# Altium schematic sheet Non-invasive glucose monitoring system.schdoc
size 304 x 194 mm
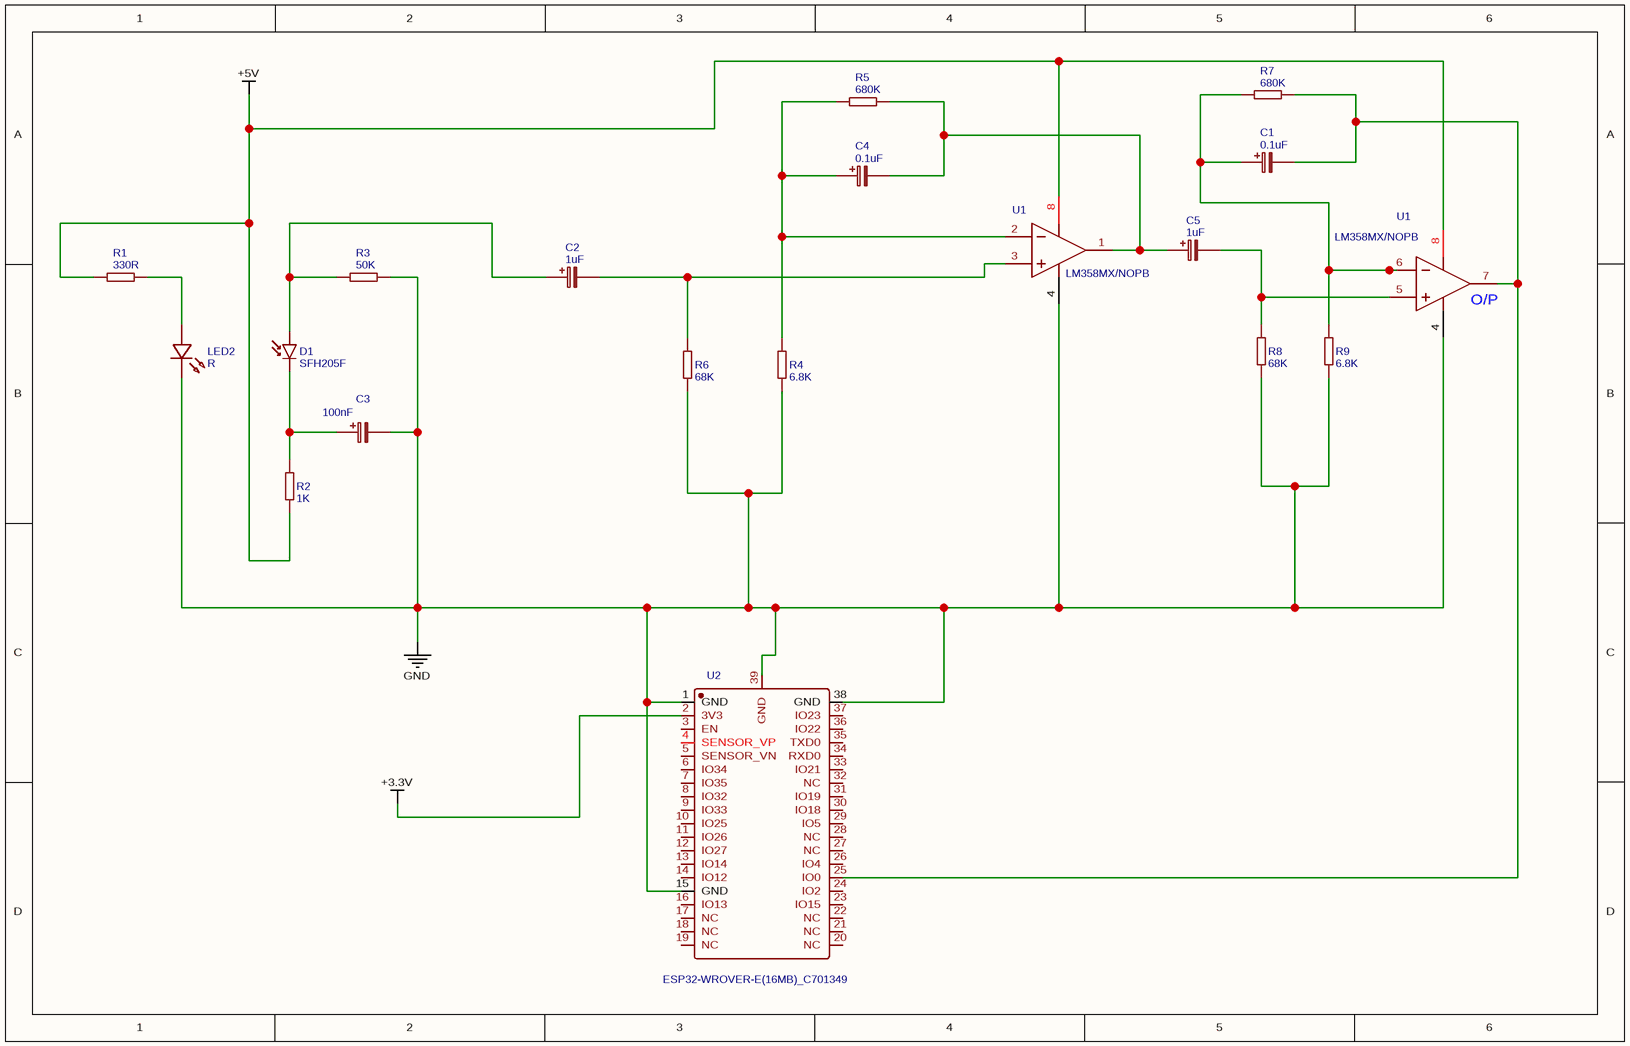
[diagram p0: Non-invasive glucose monitoring system.schdoc]

## Parts
(Parts that share a designator on the sheet are numbered #1, #2 ... from top to bottom, then left to right.)
C1  0.1uF  [CAP-D3.0×F1.5]
C2  1uF  [CAP-D3.0×F1.5]
C3  100nF  [CAP-D3.0×F1.5]
C4  0.1uF  [CAP-D3.0×F1.5]
C5  1uF  [CAP-D3.0×F1.5]
D1  SFH205F  [PHOTODIODE_SFH205]
LED2  R  [LED-TH_BD3.0_RED]
R1  330R  [RTH025W]
R2  1K  [RTH025W]
R3  50K  [RTH025W]
R4  6.8K  [RTH025W]
R5  680K  [RTH025W]
R6  68K  [RTH025W]
R7  680K  [RTH025W]
R8  68K  [RTH025W]
R9  6.8K  [RTH025W]
U1#1  LM358MX/NOPB  [SOIC-8_L4.9-W3.9-P1.27-LS6.0-BL]
U1#2  LM358MX/NOPB  [SOIC-8_L4.9-W3.9-P1.27-LS6.0-BL]
U2  ESP32-WROVER-E(16MB)_C701349  [WIFI-SMD_ESP32-WROVER-E]

## Nets
+3.3V: U2.2(3V3)
+5V: R1.1 R2.1 U1#1.8(V+) U1#2.8(V+)
GND: C3.2 LED2.2 R3.2 R4.1 R6.1 R8.1 R9.1 U1#1.4(GND) U1#2.4(GND) U2.1(GND) U2.15(GND) U2.38(GND) U2.39(GND)
NetC1_1: C1.1 R7.1 R9.2 U1#2.6(INB-)
NetC1_2: C1.2 R7.2 U1#2.7(OUTB) U2.25(IO0)
NetC2_1: C2.1 D1.2(A) R3.1
NetC2_2: C2.2 R6.2 U1#1.3(INA+)
NetC3_1: C3.1 D1.1(K) R2.2
NetC4_1: C4.1 R4.2 R5.1 U1#1.2(INA-)
NetC4_2: C4.2 C5.1 R5.2 U1#1.1(OUTA)
NetC5_2: C5.2 R8.2 U1#2.5(INB+)
NetLED2_1: LED2.1 R1.2

Not connected (* = marked no-connect by the designer): U2 3(EN) 4(SENSOR_VP) 5(SENSOR_VN) 6(IO34) 7(IO35) 8(IO32) 9(IO33) 10(IO25) 11(IO26) 12(IO27) 13(IO14) 14(IO12) 16(IO13) 17(NC) 18(NC) 19(NC) 20(NC) 21(NC) 22(NC) 23(IO15) 24(IO2) 26(IO4) 27(NC) 28(NC) 29(IO5) 30(IO18) 31(IO19) 32(NC) 33(IO21) 34(RXD0) 35(TXD0) 36(IO22) 37(IO23)

## Notes on the sheet
- (near U1#2) O/P

## Library data of the parts
C1 C4 = 0.1uF: nameAlias: Value(F); Contributor: LCEDA_Lib; spicePre: C; spiceSymbolName: CE_TH_D3.0×F1.5_EU
C2 C5 = 1uF: nameAlias: Value(F); Contributor: LCEDA_Lib; spicePre: C; spiceSymbolName: CE_TH_D3.0×F1.5_EU
C3 = 100nF: nameAlias: Value(F); Contributor: LCEDA_Lib; spicePre: C; spiceSymbolName: CE_TH_D3.0×F1.5_EU
D1 = SFH205F: Contributor: KiCAD; license: https://www.gnu.org/licenses/lgpl-2.1.html; spicePre: D; spiceSymbolName: SFH205F
LED2 = R: BOM_Manufacturer: EVERLIGHT(台湾亿光); BOM_Manufacturer Part: 204-10SDRD/S530-A3-L; Contributor: LCEDA_Lib; BOM_Supplier Part: C84774; BOM_Supplier: LCSC; spicePre: L; spiceSymbolName: LED-TH-3mm_R
R1 = 330R: Contributor: DangerousPrototype; spicePre: R; spiceSymbolName: RESISTOR
R2 = 1K: Contributor: DangerousPrototype; spicePre: R; spiceSymbolName: RESISTOR
R3 = 50K: Contributor: DangerousPrototype; spicePre: R; spiceSymbolName: RESISTOR
R4 R9 = 6.8K: Contributor: DangerousPrototype; spicePre: R; spiceSymbolName: RESISTOR
R5 R7 = 680K: Contributor: DangerousPrototype; spicePre: R; spiceSymbolName: RESISTOR
R6 R8 = 68K: Contributor: DangerousPrototype; spicePre: R; spiceSymbolName: RESISTOR
U1#1 U1#2 = LM358MX/NOPB: BOM_Manufacturer Part: TI; subpart_no: 2; Value: LM358MX/NOPB; BOM_Supplier Part: C16416; BOM_Supplier: LCSC; BOM_Manufacturer: LM358MX/NOPB; image: http://image.lceda.cn/szlcsc/C16416.jpg; BOM_JLCPCB Part Class: Extended Part; spicePre: U; spiceSymbolName: LM358MX/NOPB
U2 = ESP32-WROVER-E(16MB)_C701349: BOM_Manufacturer: Espressif Systems; Contributor: LCSC; BOM_Supplier: LCSC; BOM_Supplier Part: C701349; BOM_Manufacturer Part: ESP32-WROVER-E(16MB); spicePre: U; spiceSymbolName: ESP32-WROVER-E(16MB)_C701349